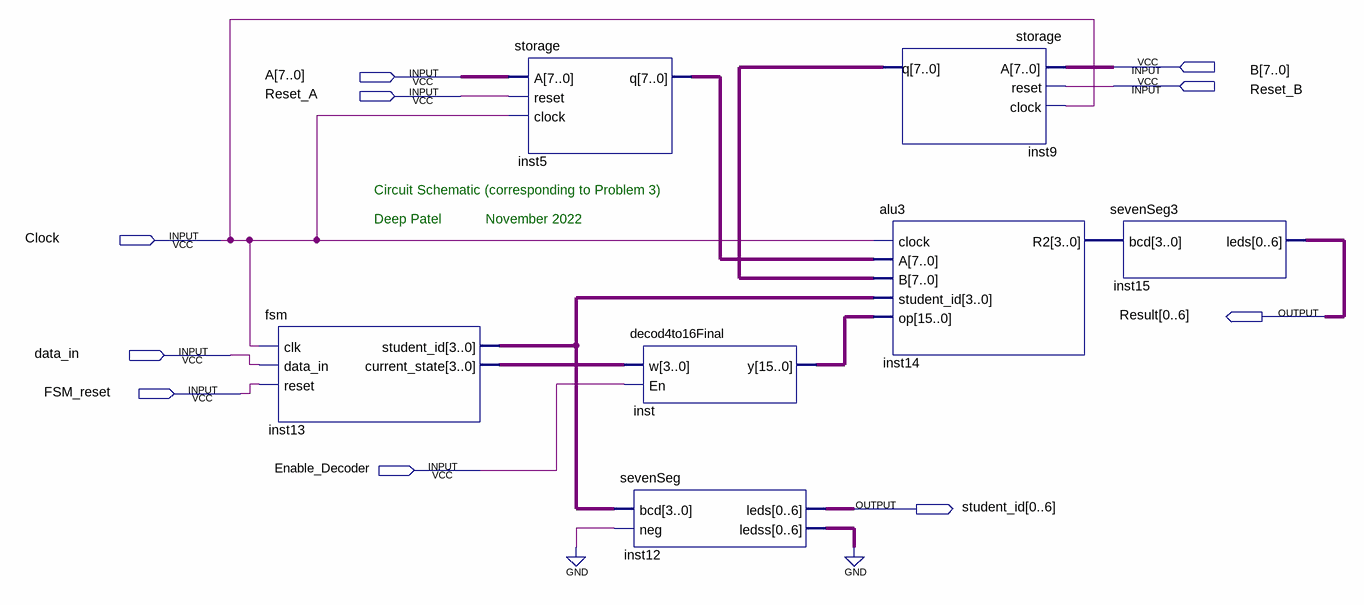
[diagram p0: schematic sheet]
// Quartus schematic block3.bdf as structural Verilog: 7 symbols, 10 pins
module block3 (
  input  [7:0] B,
  input  [7:0] A,
  input  Reset_B,
  input  Reset_A,
  input  Clock,
  input  data_in,
  input  FSM_reset,
  input  Enable_Decoder,
  output [0:6] Result,
  output [0:6] student_id
);

  wire [3:0] inst13_current_state, inst13_student_id, inst14_r2;
  wire [6:0] inst12_ledss;
  wire [7:0] inst5_q, inst9_q;
  wire [15:0] inst_y;

  fsm inst13 (
    .clk(Clock), .data_in(data_in), .reset(FSM_reset), .student_id(inst13_student_id),
    .current_state(inst13_current_state));
  storage inst5 (.A(A), .reset(Reset_A), .clock(Clock), .q(inst5_q));
  decod4to16Final inst (.w(inst13_current_state), .En(Enable_Decoder), .y(inst_y));
  sevenSeg inst12 (.bcd(inst13_student_id), .neg(1'b0), .leds(student_id), .ledss(inst12_ledss));
  alu3 inst14 (.clock(Clock), .A(inst5_q), .B(inst9_q), .student_id(inst13_student_id), .op(inst_y), .R2(inst14_r2));
  storage inst9 (.A(B), .reset(Reset_B), .clock(Clock), .q(inst9_q));
  sevenSeg3 inst15 (.bcd(inst14_r2), .leds(Result));
  // also tied to GND on the sheet: {inst12_ledss[0], inst12_ledss[1], inst12_ledss[2], inst12_ledss[3], inst12_ledss[4], inst12_ledss[5], inst12_ledss[6]}

  // Notes on the sheet:
  //   Circuit Schematic (corresponding to Problem 3)
  //   Deep Patel           November 2022 
endmodule
